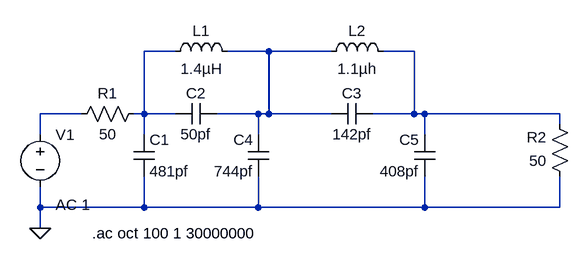
[diagram p0: schematic eliptic-5th order.asc]
eliptic-5th order.asc, the LTspice schematic file:
Version 4
SHEET 1 880 680
WIRE 224 16 176 16
WIRE 368 16 304 16
WIRE 464 16 368 16
WIRE 592 16 544 16
WIRE 80 112 16 112
WIRE 176 112 176 16
WIRE 176 112 160 112
WIRE 224 112 176 112
WIRE 352 112 288 112
WIRE 368 112 368 16
WIRE 368 112 352 112
WIRE 464 112 368 112
WIRE 592 112 592 16
WIRE 592 112 528 112
WIRE 608 112 592 112
WIRE 816 112 608 112
WIRE 816 128 816 112
WIRE 16 144 16 112
WIRE 176 144 176 112
WIRE 352 144 352 112
WIRE 608 144 608 112
WIRE 16 256 16 224
WIRE 176 256 176 208
WIRE 176 256 16 256
WIRE 352 256 352 208
WIRE 352 256 176 256
WIRE 608 256 608 208
WIRE 608 256 352 256
WIRE 816 256 816 208
WIRE 816 256 608 256
WIRE 16 288 16 256
FLAG 16 288 0
SYMBOL voltage 16 128 R0
WINDOW 123 24 124 Left 2
WINDOW 39 0 0 Left 0
SYMATTR InstName V1
SYMATTR Value ""
SYMATTR Value2 AC 1
SYMBOL res 176 96 R90
WINDOW 0 0 56 VBottom 2
WINDOW 3 32 56 VTop 2
SYMATTR InstName R1
SYMATTR Value 50
SYMBOL res 832 224 R180
WINDOW 0 36 76 Left 2
WINDOW 3 36 40 Left 2
SYMATTR InstName R2
SYMATTR Value 50
SYMBOL cap 160 144 R0
SYMATTR InstName C1
SYMATTR Value 481pf
SYMBOL cap 288 96 R90
WINDOW 0 0 32 VBottom 2
WINDOW 3 32 32 VTop 2
SYMATTR InstName C2
SYMATTR Value 50pf
SYMBOL cap 528 96 R90
WINDOW 0 0 32 VBottom 2
WINDOW 3 32 32 VTop 2
SYMATTR InstName C3
SYMATTR Value 142pf
SYMBOL cap 368 208 R180
WINDOW 0 24 56 Left 2
WINDOW 3 24 8 Left 2
SYMATTR InstName C4
SYMATTR Value 744pf
SYMBOL cap 624 208 R180
WINDOW 0 24 56 Left 2
WINDOW 3 24 8 Left 2
SYMATTR InstName C5
SYMATTR Value 408pf
SYMBOL ind 208 32 R270
WINDOW 0 32 56 VTop 2
WINDOW 3 5 56 VBottom 2
SYMATTR InstName L1
SYMATTR Value 1.4µH
SYMBOL ind 448 32 R270
WINDOW 0 32 56 VTop 2
WINDOW 3 5 56 VBottom 2
SYMATTR InstName L2
SYMATTR Value 1.1µh
TEXT 96 296 Left 2 !.ac oct 100 1 30000000

The netlist it stands for:
* eliptic-5th order.asc
V1 N004 0 AC 1
R1 N001 N004 50
R2 0 N003 50
C1 N001 0 481pf
C2 N002 N001 50pf
C3 N003 N002 142pf
C4 0 N002 744pf
C5 0 N003 408pf
L1 N001 N002 1.4µH
L2 N002 N003 1.1µh
.ac oct 100 1 30000000
.backanno
.end